# EAGLE design schema (EAGLE 9.6.2)
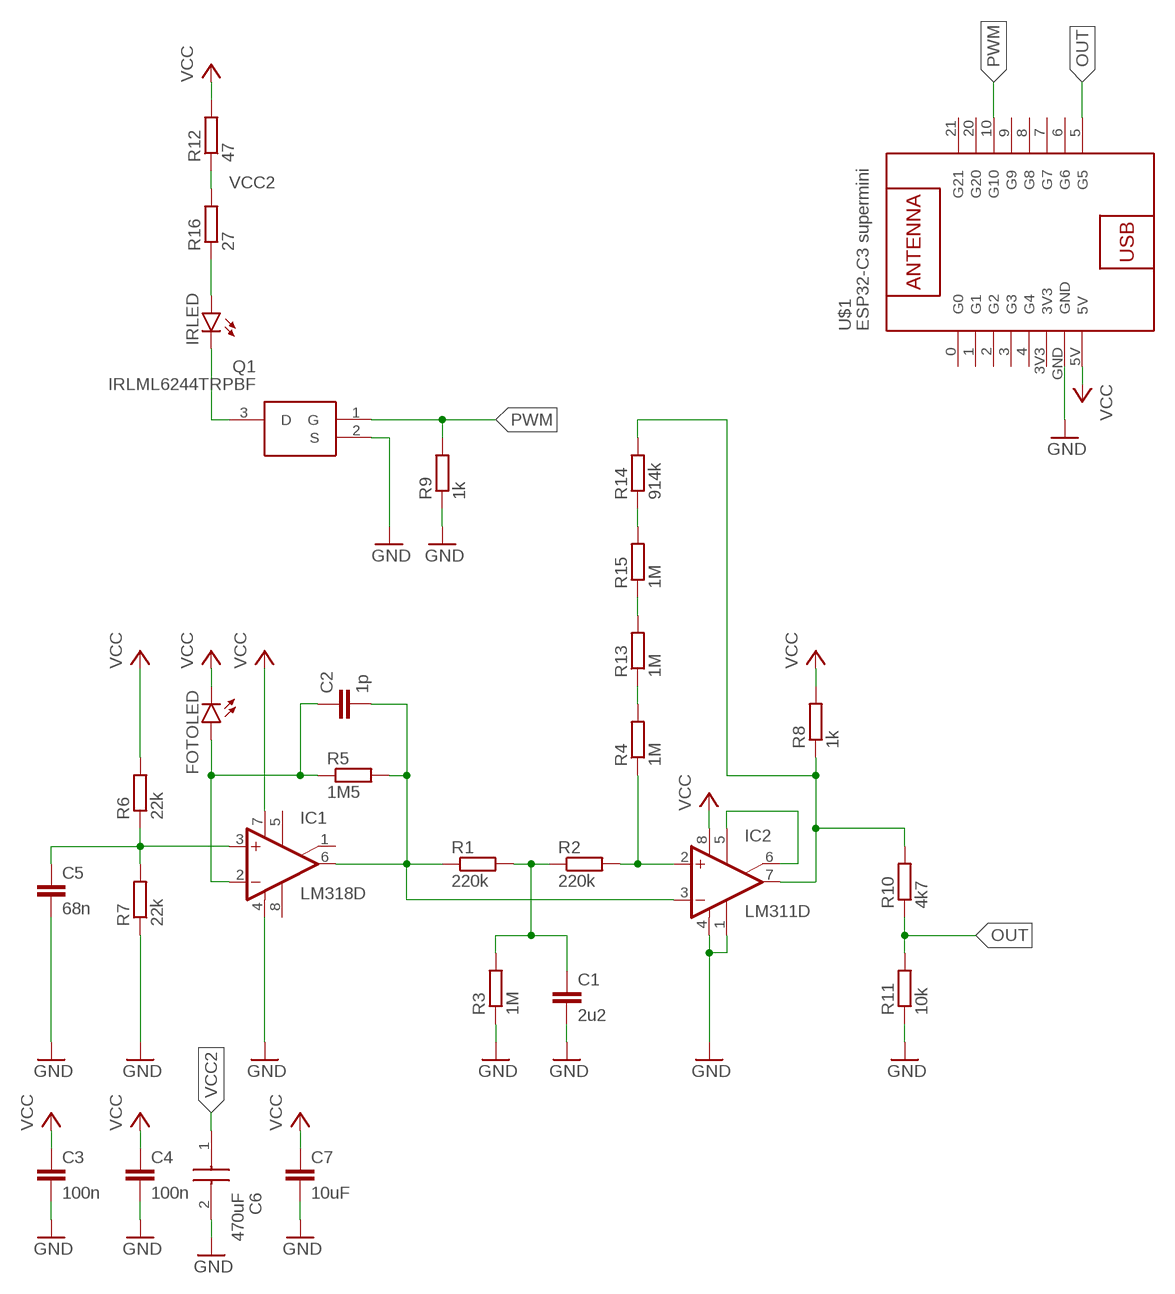
[diagram p0: schematic, sheet 1]

## Parts
C1  2u2  C-EUC0603  [C0603]
C2  1p  C-EUC0603K  [C0603K]
C3  100n  C-EUC0603  [C0603]
C4  100n  C-EUC0603  [C0603]
C5  68n  C-EUC0603  [C0603]
C6  470uF  AEA0810101M035R  [CAPAE830X1100N]
C7  10uF  C-EUC0603  [C0603]
FOTOLED  LED5MM  [LED5MM]
IC1  LM318D  [SO08]
IC2  LM311D  [SO08]
IRLED  LED5MM  [LED5MM]
Q1  IRLML6244TRPBF  [SOT95P237X112-3N]
R1  220k  R-EU_R0603  [R0603]
R2  220k  R-EU_R0603  [R0603]
R3  1M  R-EU_R0603  [R0603]
R4  1M  R-EU_R0603  [R0603]
R5  1M5  R-EU_R0603  [R0603]
R6  22k  R-EU_R0603  [R0603]
R7  22k  R-EU_R0603  [R0603]
R8  1k  R-EU_R0603  [R0603]
R9  1k  R-EU_R0603  [R0603]
R10  4k7  R-EU_R0603  [R0603]
R11  10k  R-EU_R0603  [R0603]
R12  47  R-EU_R0805  [R0805]
R13  1M  R-EU_R0603  [R0603]
R14  914k  R-EU_R0603  [R0603]
R15  1M  R-EU_R0603  [R0603]
R16  27  R-EU_R0805  [R0805]
U$1  ESP32-C3 supermini  ESP32-C3_SUPERMINI  [ESP32-C3_SUPERMINI]

## Nets
GND: C1.2 C3.2 C4.2 C5.2 C6.2(-) C7.2 IC1.4(V-) IC2.1(GND) IC2.4(V-) Q1.2(S) R3.1 R7.1 R9.1 R11.1 U$1.GND
N$1: C5.1 IC1.3(+IN) R6.1 R7.2
N$2: IC2.5(ON) IC2.6(ON/STR)
N$3: IC2.2(+IN) R2.2 R4.1
N$4: C1.1 R1.2 R2.1 R3.2
N$5: IRLED.K(C) Q1.3(D)
N$6: C2.2 IC1.6(OUT) IC2.3(-IN) R1.1 R5.2
N$7: R4.2 R13.1
N$8: IC2.7(OUT) R8.1 R10.2 R14.2
N$9: R13.2 R15.1
N$10: R14.1 R15.2
N$11: IRLED.A R16.1
OUT: R10.1 R11.2 U$1.5(G5)
PWM: Q1.1(G) R9.2 U$1.10(G10)
RE_C: C2.1 FOTOLED.A IC1.2(-IN) R5.1
VCC: C3.1 C4.1 C7.1 FOTOLED.K(C) IC1.7(V+) IC2.8(V+) R6.2 R8.2 R12.2 U$1.5V
VCC2: C6.1(+) R12.1 R16.2
Unconnected: IC1.1(ON/CMP) IC1.5(ON) IC1.8(CMP) U$1.0(G0) U$1.1(G1) U$1.2(G2) U$1.3(G3) U$1.4(G4) U$1.6(G6) U$1.7(G7) U$1.8(G8) U$1.9(G9) U$1.20(G20) U$1.21(G21)

## Power pins joined to a net without a drawn wire
3V3: U$1.3V3

## Library data of the parts
C1-C5 C7 = rcl:C-EU: CAPACITOR, European symbol; SPICEPREFIX: C
C6 = AEA0810101M035R:AEA0810101M035R: Aluminium Electrolytic Capacitors - SMD 35V 100uF 0810 20% Source: Datasheet <https://www.mouser.de/datasheet/2/40/kyocera_avx_aea_series-2526131.pdf>; DESCRIPTION: Aluminium Electrolytic Capacitors - SMD 35V 100uF 0810 20%; HEIGHT: 11mm; MANUFACTURER_NAME: Kyocera AVX; MANUFACTURER_PART_NUMBER: AEA0810101M035R
FOTOLED IRLED = led:LED: LED OSRAM: - CHIPLED LG R971, LG N971, LY N971, LG Q971, LY Q971, LO R971, LY R971 LH N974, LH R974 LS Q976, LO Q976, LY Q976 LO Q996 - Hyper CHIPLED LW Q18S LB Q993, LB Q99A, LB R99A - SideLED LS A670, LO A670, LY A670, LG A670, LP A670 LB A673, LV A673, LT A673, LW A673 LH A674 LY A675 LS A676, LA A676, LO A676, LY A676, LW A676 LS A679, LY A679, LG A679 - Hyper Micro SIDELED® LS Y876, LA Y876, LO Y876, LY Y876 LT Y87S - SmartLED LW L88C, LW L88S LB L89C, LB L89S, LG L890 LS L89K, LO L89K, LY L89K LS L896, LA L896, LO L896, LY L896 - TOPLED LS T670, LO T670, LY T670, LG T670, LP T670 LSG T670, LSP T670, LSY T670, LOP T670, LYG T670 LG T671, LOG T671, LSG T671 LB T673, LV T673, LT T673, LW T673 LH T674 LS T676, LA T676, LO T676, LY T676, LB T676, LH T676, LSB T676, LW T676 LB T67C, LV T67C, LT T67C, LS T67K, LO T67K, LY T67K, LW E67C LS E67B, LA E67B, LO E67B, LY E67B, LB E67C, LV E67C, LT E67C LW T67C LS T679, LY T679, LG T679 LS T770, LO T770, LY T770, LG T770, LP T770 LB T773, LV T773, LT T773, LW T773 LH T774 LS E675, LA E675, LY E675, LS T675 LS T776, LA T776, LO T776, LY T776, LB T776 LHGB T686 LT T68C, LB T68C - Hyper Mini TOPLED® LB M676 - Mini TOPLED Santana® LG M470 LS M47K, LO M47K, LY M47K Source: http://www.osram.convergy.de LUXEON: - LUMILED® LXK2-PW12-R00, LXK2-PW12-S00, LXK2-PW14-U00, LXK2-PW14-V00 LXK2-PM12-R00, LXK2-PM12-S00, LXK2-PM14-U00 LXK2-PE12-Q00, LXK2-PE12-R00, LXK2-PE12-S00, LXK2-PE14-T00, LXK2-PE14-U00 LXK2-PB12-K00, LXK2-PB12-L00, LXK2-PB12-M00, LXK2-PB14-N00, LXK2-PB14-P00, LXK2-PB14-Q00 LXK2-PR12-L00, LXK2-PR12-M00, LXK2-PR14-Q00, LXK2-PR14-R00 LXK2-PD12-Q00, LXK2-PD12-R00, LXK2-PD12-S00 LXK2-PH12-R00, LXK2-PH12-S00 LXK2-PL12-P00, LXK2-PL12-Q00, LXK2-PL12-R00 Source: www.luxeon.com KINGBRIGHT: KA-3528ASYC Source: www.kingbright.com
IC1 = linear:LM318: OP AMP
IC2 = linear:LM311: COMPARATOR
Q1 = IRLML6244TRPBF:IRLML6244TRPBF: INFINEON - IRLML6244TRPBF - MOSFET, N CH, 20V, 6.3A, SOT-23 Source: Datasheet <http://www.infineon.com/dgdl/irlml6244pbf.pdf?fileId=5546d462533600a4015356686fed261f>; DESCRIPTION: INFINEON - IRLML6244TRPBF - MOSFET, N CH, 20V, 6.3A, SOT-23; HEIGHT: 1.12mm; MANUFACTURER_NAME: Infineon; MANUFACTURER_PART_NUMBER: IRLML6244TRPBF
R1-R16 = rcl:R-EU_: RESISTOR, European symbol; SPICEPREFIX: R
U$1 = ESP32C3supermini:ESP32-C3_SUPERMINI

## Board
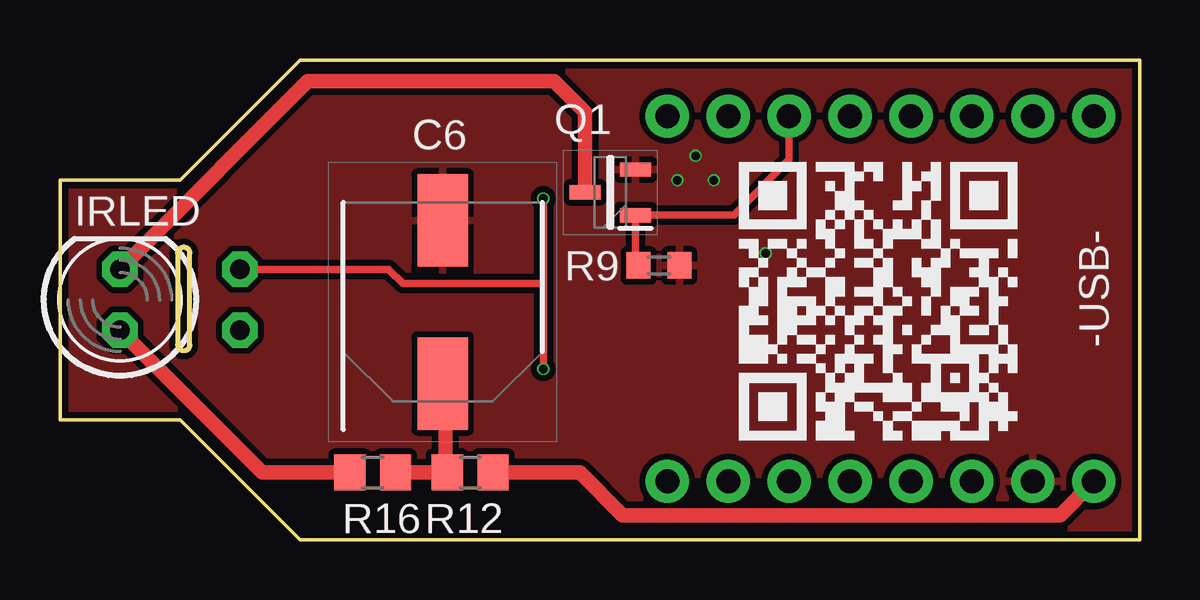
[diagram p1: board, top side]
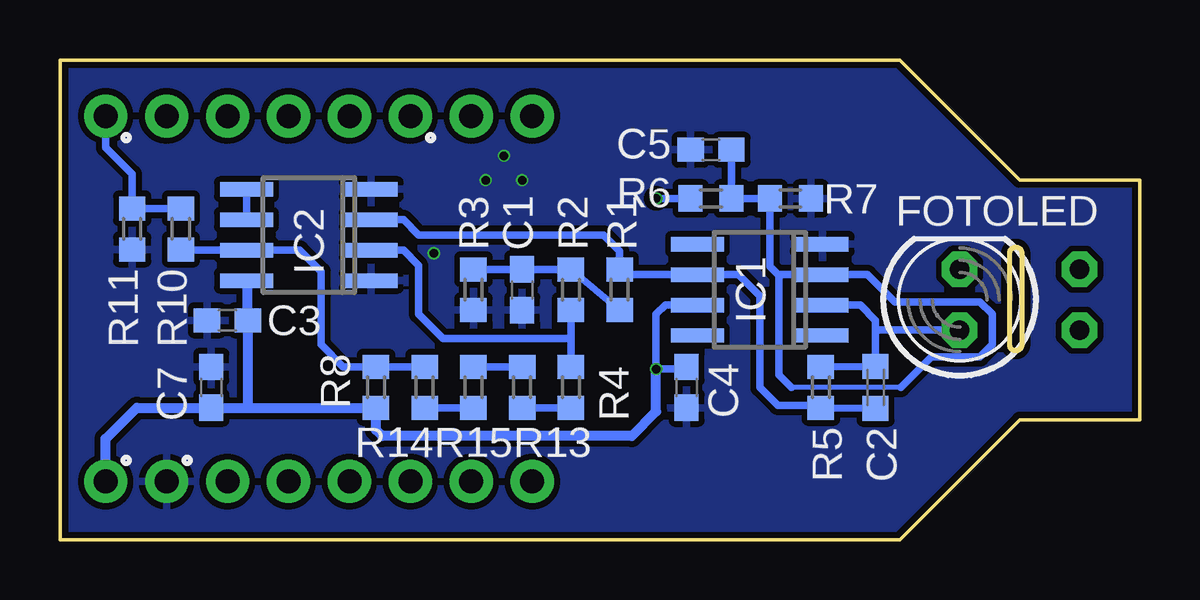
[diagram p2: board, bottom side, seen from below]

Size 45 x 20 mm. Coordinates in mm from the lower left corner, seen from the top.
Outline: 0,15 0,5 5,5 10,0 45,0 45,20 10,20 5,15 0,15
Outline: 5.41,11.94 arc90 5.16,12.19 arc90 4.91,11.94 4.91,8.13 arc90 5.16,7.87 arc90 5.41,8.13 5.41,11.94
Copper layers (1*16): Top 0.035mm / dielectric 1.6mm / Bottom 0.035mm
Design rules "jlcpcb-2layers": minimum track width 5mil, minimum drill 0.3mm, track to track 5mil, track to pad 5mil, pad to pad 5mil, via to via 5mil, smd to smd 5mil, copper to edge 0.2mm, drill to drill 6mil, minimum pad ring 10mil, minimum via ring 3mil, stop-mask expansion 4mil, vias tented up to drill 0mil, thermal gap 10mil

### Footprints (pad centres in the part's own frame; a part is rotated, then mirrored left to right if it is on the bottom)
C0603 = smd 1.1 x 1: 1 -0.85,0; 2 0.85,0
C0603K = smd 1.05 x 1.08: 1 -0.875,0; 2 0.875,0
CAPAE830X1100N = smd 3.85 x 2.1: 1 -3.4,0; 2 3.4,0
LED5MM = drill 0.813 octagon: A -1.27,0; K 1.27,0
SO08 = smd 0.6 x 2.2: 1 -1.905,-2.6; 2 -0.635,-2.6; 3 0.635,-2.6; 4 1.905,-2.6; 5 1.905,2.6; 6 0.635,2.6; 7 -0.635,2.6; 8 -1.905,2.6
SOT95P237X112-3N = smd 1.3 x 0.6: 1 -1.05,0.95; 2 -1.05,-0.95; 3 1.05,0
R0603 = smd 1 x 1.1: 1 -0.85,0; 2 0.85,0
R0805 = smd 1.3 x 1.5: 1 -0.95,0; 2 0.95,0
ESP32-C3_SUPERMINI = drill 1: 0 -11.43,9.525; 1 -11.43,6.985; 2 -11.43,4.445; 3 -11.43,1.905; 3V3 -11.43,-3.175; 4 -11.43,-0.635; 5 3.81,-8.255; 5V -11.43,-8.255; 6 3.81,-5.715; 7 3.81,-3.175; 8 3.81,-0.635; 9 3.81,1.905; 10 3.81,4.445; 20 3.81,6.985; 21 3.81,9.525; GND -11.43,-5.715

### Placement (x,y rotation side)
C1  25.73,10.41 270 bottom
C2  11,6.35 270 bottom
C3  38.02,9.14 180 bottom
C4  18.88,6.35 270 bottom
C5  17.86,16.26 180 bottom
C6  15.96,9.91 90 top
C7  38.69,6.35 90 bottom
FOTOLED  7.5,10 90 bottom
IC1  15.83,10.41 90 bottom
IC2  34.62,12.7 90 bottom
IRLED  2.5,10 90 top
Q1  22.94,14.48 180 top
R1  21.67,10.41 270 bottom
R2  23.7,10.41 270 bottom
R3  27.77,10.41 90 bottom
R4  23.7,6.35 270 bottom
R5  13.29,6.35 270 bottom
R6  17.86,14.22 180 bottom
R7  14.56,14.22 180 bottom
R8  31.83,6.35 270 bottom
R9  24.97,11.43 180 top
R10  39.96,12.95 270 bottom
R11  41.99,12.95 90 bottom
R12  17.1,2.79 0 top
R13  25.73,6.35 90 bottom
R14  29.8,6.35 90 bottom
R15  27.77,6.35 270 bottom
R16  13.03,2.79 0 top
U$1  34.84,13.85 90 top

### Tracks (layer width: path | path; a pad name or v marks a point on that pad's centre or on a via)
GND  (via drill 0.35)
  other vias: 26.5,16 25.73,14.99 27.26,14.99 29.42,11.94
  pour Top (isolate 0.254): 45.04,20.07 9.99,20.07 4.91,14.99 0.08,14.99 0.08,5.08 4.91,5.08 9.99,0 45.04,0
  pour Bottom (isolate 0.254): 45.04,20.07 9.99,20.07 4.91,14.99 -0.43,14.99 -0.43,5.08 4.91,5.08 9.99,0 45.04,0
N$1
  Bottom 0.203: 9.95,6.35 14.52,6.35
  Bottom 0.305: C5.1 R6.1 R7.2 15.41,11.39 15.07,11.05 | 15.07,11.05 IC1.3 11.35,11.05 10.2,9.91 6.65,9.91 6.14,9.4 6.14,8.13 6.65,7.62 8.68,7.62 9.95,6.35 | 15.07,11.05 15.03,11.01 15.03,6.86 14.52,6.35
N$2
  Bottom 0.305: IC2.5 IC2.6
N$3
  Bottom 0.305: R2.2 23.7,8.38 | R4.1 23.7,8.38 | IC2.2 30.69,12.06 30.05,11.43 30.05,9.4 29.04,8.38 23.7,8.38
N$4
  Bottom 0.305: R3.2 C1.1 R2.1 R1.2
N$5
  Top 0.61: IRLED.K 3,11.79 10.32,19.11 20.59,19.11 21.89,17.81 Q1.3
N$6
  Bottom 0.305: IC2.3 30.69,13.34 30.05,12.7 22.34,12.7 21.67,12.03 R1.1 21.45,11.05 IC1.6 16.72,11.05 15.83,10.16 15.83,6.35 15.07,5.59 13.38,5.59 R5.2 C2.2
N$7
  Bottom 0.305: R4.2 R13.1
N$8
  Bottom 0.305: R14.2 R8.1 33.19,7.2 34.12,8.13 34.12,11.18 35.01,12.06 IC2.7 39.92,12.06 R10.2
N$9
  Bottom 0.305: R13.2 R15.1
N$10
  Bottom 0.305: R15.2 R14.1
N$11
  Top 0.61: R16.1 8.42,2.79 3,8.21 IRLED.A
OUT
  Bottom 0.305: R10.1 R11.2 41.99,15.24 43.09,16.34 U$1.5
PWM
  Top 0.305: U$1.10 30.39,15.84 28.09,13.53 Q1.1 23.99,11.56 R9.2
RE_C
  Bottom 0.305: R5.1 C2.1 11,8.64 | IC1.2 11.64,9.78 11,9.14 11,8.64 | FOTOLED.A 10.91,8.73 11,8.64
VCC  (via drill 0.35)
  Top 0.305: v20.15,14.22 20.15,10.67 | 20.15,10.67 v20.15,7.11 | FOTOLED.K 13.7,11.27 14.3,10.67 20.15,10.67
  Top 0.61: R12.2 21.67,2.79 23.45,1.02 41.69,1.02 U$1.5V
  Bottom 0.305: IC1.7 19.77,9.78 20.15,9.4 v20.15,7.11 18.96,7.11 C4.1 | R6.2 v20.15,14.22 | 37.17,10.74 IC2.8 | 37.17,5.54 37.21,5.5
  Bottom 0.406: v20.15,7.11 20.15,5.33 21.16,4.32 31.58,4.32 31.83,4.57 R8.2 37.21,5.5 C7.1 41.8,5.5 43.09,4.2 43.09,3.56 U$1.5V | 37.17,10.74 C3.1 37.17,5.54
VCC2
  Top 0.61: R16.2 R12.1 16.08,2.86 16.08,6.38 C6.1

### Text on the board
bStop: FEKT UFYZ / Vaníček 3/2025